# Altium schematic sheet vme_can_main.SchDoc: =GlobalProjectName
size 410 x 297 mm; SheetNumber: 1; SheetTotal: 8; PageSetup: Record=PageOptions|CenterHorizontal=True|CenterVertical=True|PrintScale=1.00|XCorrection=1.00|YCorrection=1.00|PrintKind=1|BorderSize=5000000|LeftOffset=0|BottomOffset=0|Orientation=2|PaperLength=1000|PaperWidth=1000|Scale=100|PaperSource=15|PrintQuality=1200|MediaType=1|DitherType=10|PaperKind=A3|PrintScaleMode=1; Weight: -; ScaleFactor: -
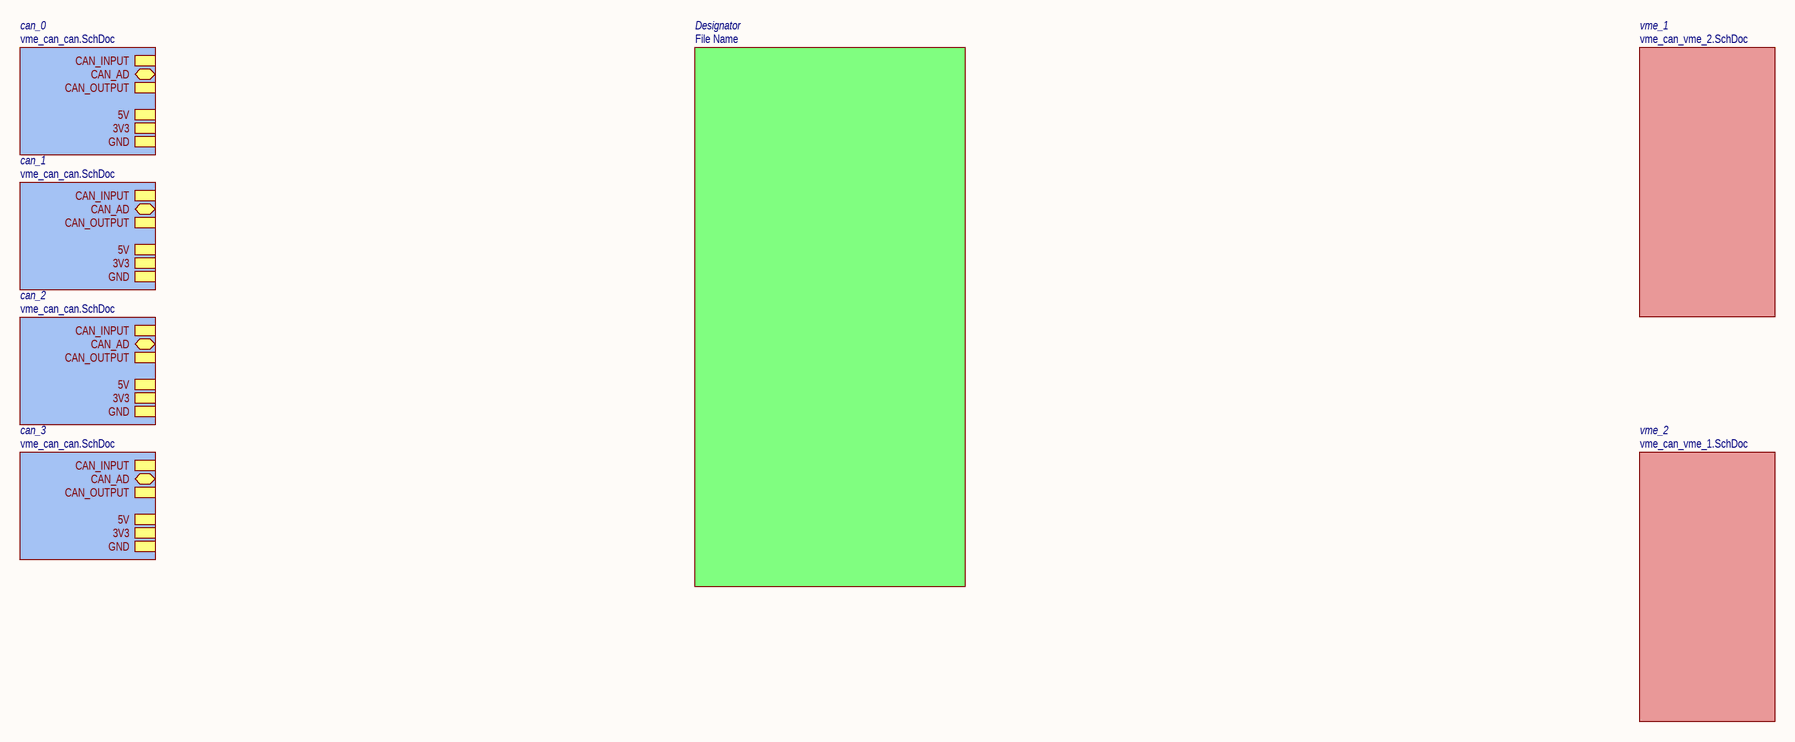
[diagram p0: vme_can_main.SchDoc]

## Sub-sheets
can_0 = vme_can_can.SchDoc: 5V, GND, CAN_AD (bidir), CAN_INPUT (harness FPGA_CAN_INPUT), 3V3, CAN_OUTPUT (harness FPGA_CAN_OUPUT)
can_1 = vme_can_can.SchDoc: 5V, GND, CAN_AD (bidir), CAN_INPUT (harness FPGA_CAN_INPUT), 3V3, CAN_OUTPUT (harness FPGA_CAN_OUPUT)
can_2 = vme_can_can.SchDoc: 5V, GND, CAN_AD (bidir), CAN_INPUT (harness FPGA_CAN_INPUT), 3V3, CAN_OUTPUT (harness FPGA_CAN_OUPUT)
can_3 = vme_can_can.SchDoc: 5V, GND, CAN_AD (bidir), CAN_INPUT (harness FPGA_CAN_INPUT), 3V3, CAN_OUTPUT (harness FPGA_CAN_OUPUT)
Designator = File Name: no entries
vme_1 = vme_can_vme_2.SchDoc: no entries
vme_2 = vme_can_vme_1.SchDoc: no entries

## Notes on the sheet
- Перв. примен.
- Справ. №
- Подп. и дата
- Инв. № дубл.
- Взам. инв. №
- Изм.
- Разраб.
- Лист
- № докум.
- Подп.
- Дата
- Литера
- Масса
- Масштаб
- Пров.
- Т.контр.
- Листов
- Н.контр.
- Утв.
- Инв. № подл.
- Форма 1 ГОСТ 2.104-2006
- Копировал
- Формат А3